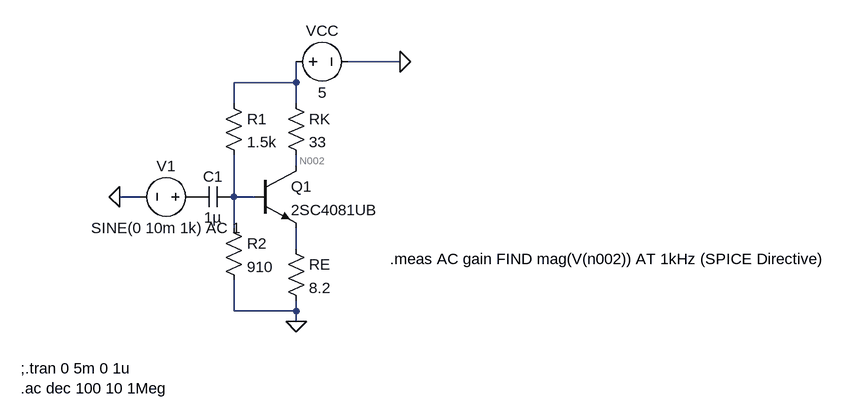
[diagram p0: schematic lab2_task4.asc]
lab2_task4.asc, the LTspice schematic file:
Version 4
SHEET 1 1084 680
WIRE 384 80 304 80
WIRE 224 112 224 80
WIRE 224 112 128 112
WIRE 128 144 128 112
WIRE 224 144 224 112
WIRE 224 240 224 224
WIRE -16 288 -48 288
WIRE 128 288 128 224
WIRE 160 288 128 288
WIRE 128 336 128 288
WIRE 224 368 224 336
WIRE 128 464 128 416
WIRE 224 464 224 448
WIRE 224 464 128 464
WIRE 224 480 224 464
FLAG 384 80 0
FLAG 224 480 0
FLAG -48 288 0
SYMBOL voltage 208 80 R270
WINDOW 0 32 56 VTop 2
WINDOW 3 -32 56 VBottom 2
SYMATTR InstName VCC
SYMATTR Value 5
SYMBOL npn 160 240 R0
SYMATTR InstName Q1
SYMATTR Value 2SC4081UB
SYMBOL res 208 128 R0
SYMATTR InstName RK
SYMATTR Value 33
SYMBOL res 208 352 R0
SYMATTR InstName RE
SYMATTR Value 8.2
SYMBOL res 112 128 R0
SYMATTR InstName R1
SYMATTR Value 1.5k
SYMBOL res 112 320 R0
SYMATTR InstName R2
SYMATTR Value 910
SYMBOL voltage 80 288 R90
WINDOW 0 -32 56 VBottom 2
WINDOW 3 32 56 VTop 2
WINDOW 123 0 0 Left 0
WINDOW 39 0 0 Left 0
SYMATTR InstName V1
SYMATTR Value SINE(0 10m 1k) AC 1
SYMBOL cap 128 272 R90
WINDOW 0 0 32 VBottom 2
WINDOW 3 32 32 VTop 2
SYMATTR InstName C1
SYMATTR Value 1µ
TEXT -200 552 Left 2 !;.tran 0 5m 0 1u\n.ac dec 100 10 1Meg
TEXT 368 384 Left 2 !.meas AC gain FIND mag(V(n002)) AT 1kHz (SPICE Directive)

The netlist it stands for:
* lab2_task4.asc
VCC N001 0 5
Q1 N002 N003 N004 0 2SC4081UB
RK N001 N002 33
RE N004 0 8.2
R1 N001 N003 1.5k
R2 N003 0 910
V1 P001 0 SINE(0 10m 1k) AC 1
C1 N003 P001 1µ
.model NPN NPN
.model PNP PNP
.lib standard.bjt
;.tran 0 5m 0 1u
.ac dec 100 10 1Meg
.meas AC gain FIND mag(V(n002)) AT 1kHz (SPICE Directive)
.backanno
.end